# Altium schematic sheet RecevieModels.SchDoc
size A4
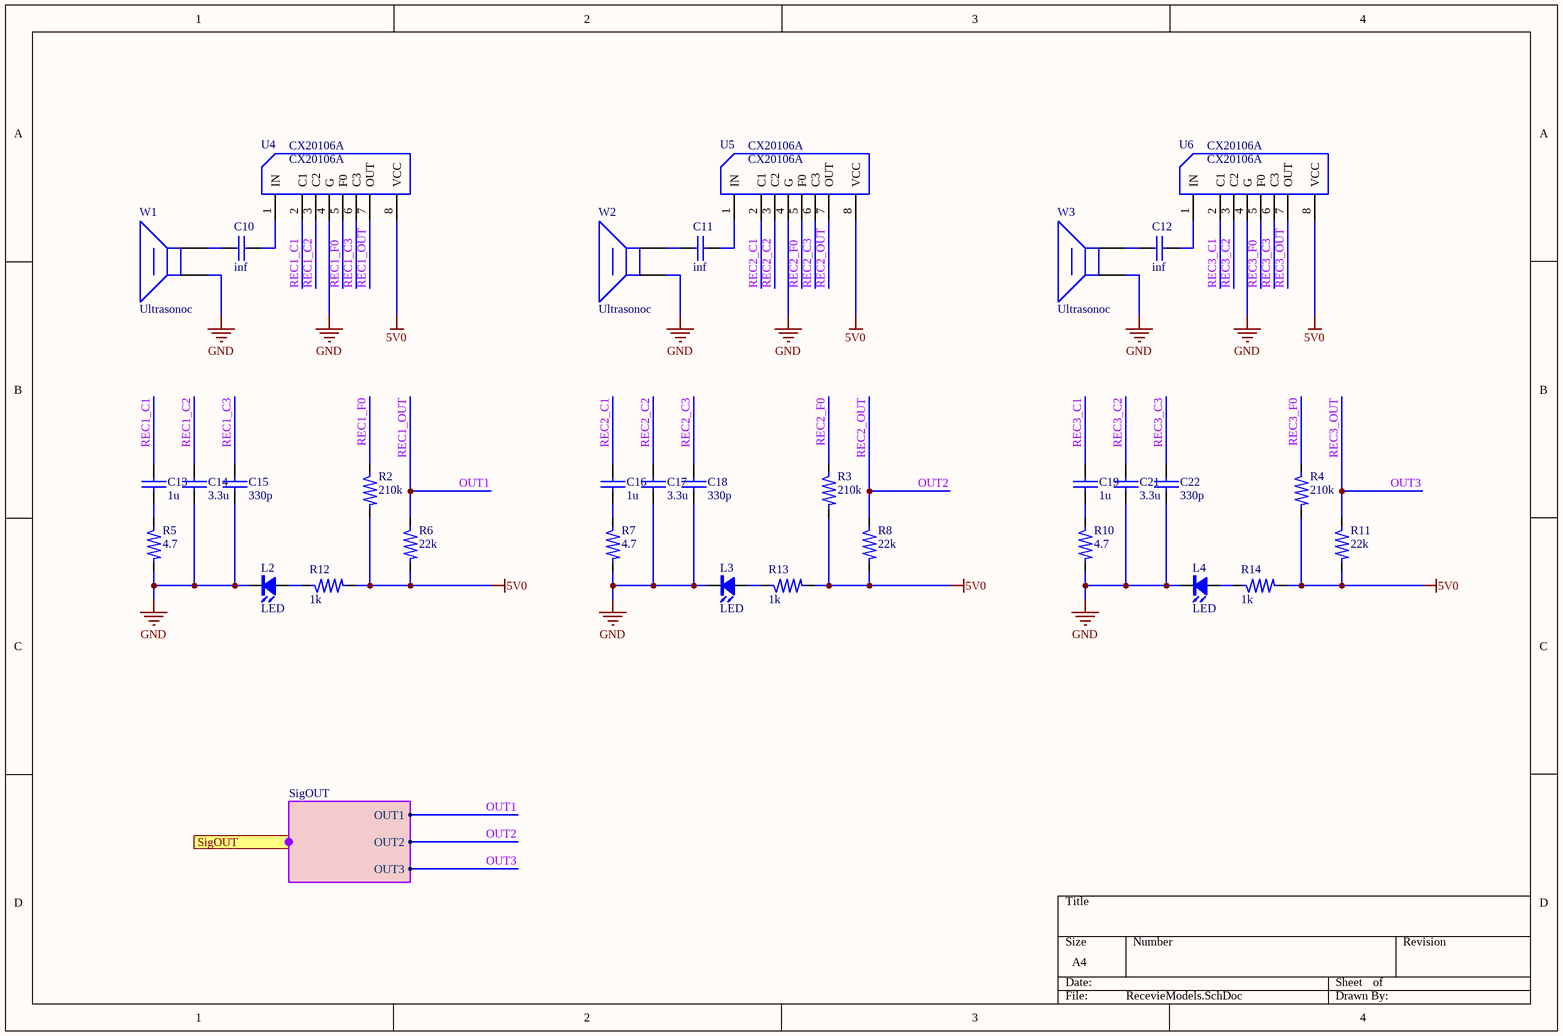
[diagram p0: RecevieModels.SchDoc]

## Parts
C10  inf  [C0603]
C11  inf  [C0603]
C12  inf  [C0603]
C13  1u  [C0603]
C14  3.3u  [C0603]
C15  330p  [C0603]
C16  1u  [C0603]
C17  3.3u  [C0603]
C18  330p  [C0603]
C19  1u  [C0603]
C21  3.3u  [C0603]
C22  330p  [C0603]
L2  LED  [LED0805TB]
L3  LED  [LED0805TB]
L4  LED  [LED0805TB]
R2  210k  [R0603]
R3  210k  [R0603]
R4  210k  [R0603]
R5  4.7  [R0603]
R6  22k  [R0603]
R7  4.7  [R0603]
R8  22k  [R0603]
R10  4.7  [R0603]
R11  22k  [R0603]
R12  1k  [R0603]
R13  1k  [R0603]
R14  1k  [R0603]
U4  CX20106A  [8Pin_100mil]
U5  CX20106A  [8Pin_100mil]
U6  CX20106A  [8Pin_100mil]
W1  Ultrasonoc  [Circle_1cm]
W2  Ultrasonoc  [Circle_1cm]
W3  Ultrasonoc  [Circle_1cm]

## Ports
SigOUT (harness SigOUT)

## Harnesses
SigOUT: OUT1, OUT2, OUT3

## Nets
5V0: R2.1 R3.1 R4.1 R6.1 R8.1 R11.1 R12.1 R13.1 R14.1 U4.8(VCC) U5.8(VCC) U6.8(VCC)
GND: C14.2 C15.2 C17.2 C18.2 C21.2 C22.2 L2.2(K) L3.2(K) L4.2(K) R5.1 R7.1 R10.1 U4.4(G) U5.4(G) U6.4(G) W1.1 W2.1 W3.1
OUT1: R6.2 U4.7(OUT) ; port SigOUT.OUT1  [also labelled REC1_OUT]
OUT2: R8.2 U5.7(OUT) ; port SigOUT.OUT2  [also labelled REC2_OUT]
OUT3: R11.2 U6.7(OUT) ; port SigOUT.OUT3  [also labelled REC3_OUT]
REC1_C1: C13.1 U4.2(C1)
REC1_C2: C14.1 U4.3(C2)
REC1_C3: C15.1 U4.6(C3)
REC1_F0: R2.2 U4.5(F0)
REC2_C1: C16.1 U5.2(C1)
REC2_C2: C17.1 U5.3(C2)
REC2_C3: C18.1 U5.6(C3)
REC2_F0: R3.2 U5.5(F0)
REC3_C1: C19.1 U6.2(C1)
REC3_C2: C21.1 U6.3(C2)
REC3_C3: C22.1 U6.6(C3)
REC3_F0: R4.2 U6.5(F0)
NetC10_1: C10.1 W1.2
NetC10_2: C10.2 U4.1(IN)
NetC11_1: C11.1 W2.2
NetC11_2: C11.2 U5.1(IN)
NetC12_1: C12.1 W3.2
NetC12_2: C12.2 U6.1(IN)
NetC13_2: C13.2 R5.2
NetC16_2: C16.2 R7.2
NetC19_2: C19.2 R10.2
NetL2_1: L2.1(A) R12.2
NetL3_1: L3.1(A) R13.2
NetL4_1: L4.1(A) R14.2

## Library data of the parts
C10-C19 C21 C22 = Capacitor: 电容
R2-R8 R10-R14 = Resistor: 电阻
W1-W3 = Ultrasonic